# EAGLE design soccerbot (EAGLE 8.3.0)

## Sheet 1 of 4
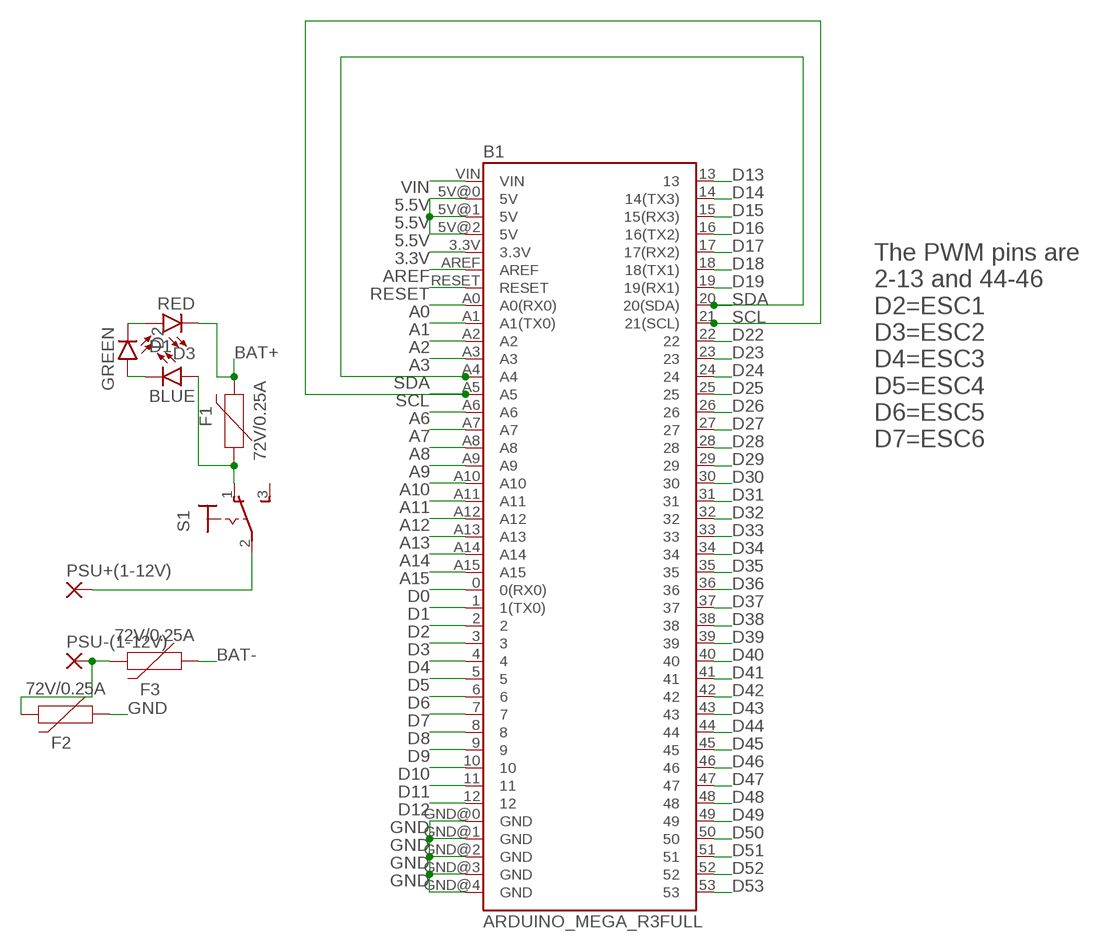
[diagram p0: schematic, sheet 1]

### Parts
B1  ARDUINO_MEGA_R3FULL  [ARDUINO_MEGA]
D1  BLUE  LED-BLUE1206  [LED-1206]
D2  GREEN  LED-GREEN0603  [LED-0603]
D3  RED  LED-RED0603  [LED-0603]
F1  72V/0.25A  PPTC_PTH  [PTH]
F2  72V/0.25A  PPTC_PTH  [PTH]
F3  72V/0.25A  PPTC_PTH  [PTH]
PSU+(1-12V)  SMD5  [SMD2,54-5,08]
PSU-(1-12V)  SMD5  [SMD2,54-5,08]
S1  320-916  [320-916]

### Nets
3.3V: B1.3.3V ; also sheet 2
5.5V: B1.5V@0(5V) B1.5V@1(5V) B1.5V@2(5V)
A0: B1.A0(A0(RX0))
A1: B1.A1(A1(TX0))
A2: B1.A2
A3: B1.A3
A6: B1.A6
A7: B1.A7
A8: B1.A8
A9: B1.A9
A10: B1.A10
A11: B1.A11
A12: B1.A12
A13: B1.A13
A14: B1.A14
A15: B1.A15
AREF: B1.AREF
BAT+: D3.C F1.P$2 ; also sheet 4
BAT-: F2.P$2 F3.P$1 F3.P$2 PSU-(1-12V).1(P) ; also sheet 4
D0: B1.0(0(RX0))
D1: B1.1(1(TX0))
D2: B1.2 ; also sheet 4
D3: B1.3 ; also sheet 4
D4: B1.4 ; also sheet 4
D5: B1.5 ; also sheet 4
D6: B1.6 ; also sheet 4
D7: B1.7 ; also sheet 4
D8: B1.8
D9: B1.9
D10: B1.10
D11: B1.11
D12: B1.12
D13: B1.13
D14: B1.14(14(TX3))
D15: B1.15(15(RX3))
D16: B1.16(16(TX2))
D17: B1.17(17(RX2))
D18: B1.18(18(TX1))
D19: B1.19(19(RX1))
D22: B1.22
D23: B1.23
D24: B1.24
D25: B1.25
D26: B1.26
D27: B1.27
D28: B1.28
D29: B1.29
D30: B1.30
D31: B1.31
D32: B1.32
D33: B1.33
D34: B1.34
D35: B1.35
D36: B1.36
D37: B1.37
D38: B1.38
D39: B1.39
D40: B1.40
D41: B1.41
D42: B1.42
D43: B1.43
D44: B1.44
D45: B1.45
D46: B1.46
D47: B1.47
D48: B1.48
D49: B1.49
D50: B1.50
D51: B1.51
D52: B1.52
D53: B1.53
GND: B1.GND@0(GND) B1.GND@1(GND) B1.GND@2(GND) B1.GND@3(GND) B1.GND@4(GND) F2.P$1 ; also sheet 2,3,4
N$3: D1.C D2.A
N$4: PSU+(1-12V).1(P) S1.2(P)
N$5: D2.C D3.A
N$6: D1.A F1.P$1 S1.1(O)
RESET: B1.RESET
SCL: B1.21(21(SCL)) B1.A5 ; also sheet 2,3
SDA: B1.20(20(SDA)) B1.A4 ; also sheet 2,3
VIN: B1.VIN ; also sheet 2,3,4
Unconnected: S1.3(S)

### Notes on the sheet
- The PWM pins are
  2-13 and 44-46
  D2=ESC1
  D3=ESC2
  D4=ESC3
  D5=ESC4
  D6=ESC5
  D7=ESC6

## Sheet 2 of 4
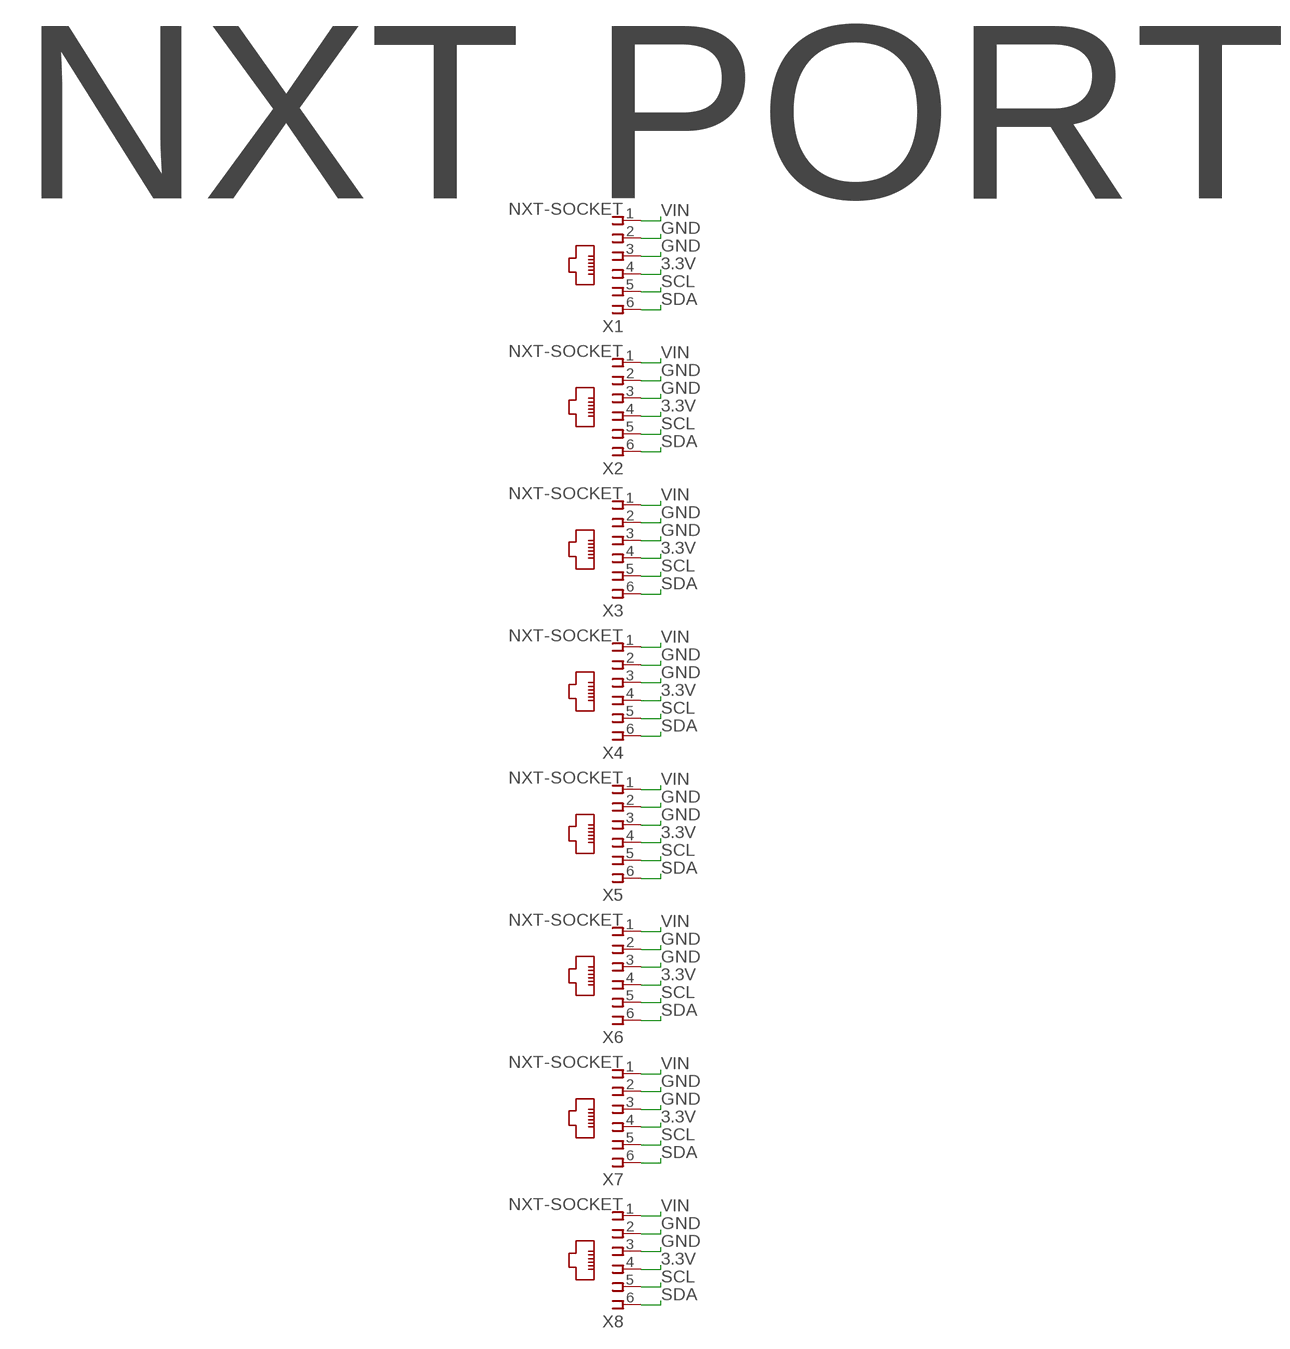
[diagram p1: schematic, sheet 2]

### Parts
X1  NXT-SOCKET  [NXT-SOCKET]
X2  NXT-SOCKET  [NXT-SOCKET]
X3  NXT-SOCKET  [NXT-SOCKET]
X4  NXT-SOCKET  [NXT-SOCKET]
X5  NXT-SOCKET  [NXT-SOCKET]
X6  NXT-SOCKET  [NXT-SOCKET]
X7  NXT-SOCKET  [NXT-SOCKET]
X8  NXT-SOCKET  [NXT-SOCKET]

### Nets
3.3V: X1.4 X2.4 X3.4 X4.4 X5.4 X6.4 X7.4 X8.4 ; also sheet 1
GND: X1.2 X1.3 X2.2 X2.3 X3.2 X3.3 X4.2 X4.3 X5.2 X5.3 X6.2 X6.3 X7.2 X7.3 X8.2 X8.3 ; also sheet 1,3,4
SCL: X1.5 X2.5 X3.5 X4.5 X5.5 X6.5 X7.5 X8.5 ; also sheet 1,3
SDA: X1.6 X2.6 X3.6 X4.6 X5.6 X6.6 X7.6 X8.6 ; also sheet 1,3
VIN: X1.1 X2.1 X3.1 X4.1 X5.1 X6.1 X7.1 X8.1 ; also sheet 1,3,4

### Notes on the sheet
- NXT PORTS

## Sheet 3 of 4
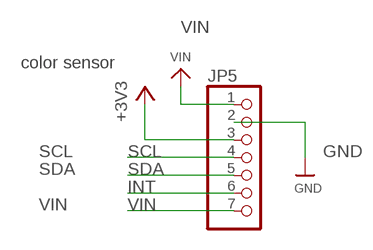
[diagram p2: schematic, sheet 3]

### Parts
JP5  HEADER-1X770MIL  [1X07_ROUND_70]

### Nets
+3V3: JP5.3
GND: JP5.2 ; also sheet 1,2,4
INT: JP5.6
SCL: JP5.4 ; also sheet 1,2
SDA: JP5.5 ; also sheet 1,2
VIN: JP5.1 JP5.7 ; also sheet 1,2,4

### Notes on the sheet
- color sensor

## Sheet 4 of 4
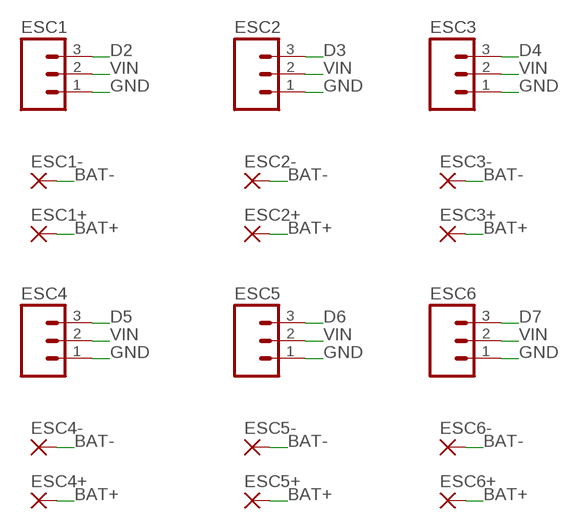
[diagram p3: schematic, sheet 4]

### Parts
ESC1  M03LOCK  [1X03_LOCK]
ESC1+  SMD5  [SMD2,54-5,08]
ESC1-  SMD5  [SMD2,54-5,08]
ESC2  M03LOCK  [1X03_LOCK]
ESC2+  SMD5  [SMD2,54-5,08]
ESC2-  SMD5  [SMD2,54-5,08]
ESC3  M03LOCK  [1X03_LOCK]
ESC3+  SMD5  [SMD2,54-5,08]
ESC3-  SMD5  [SMD2,54-5,08]
ESC4  M03LOCK  [1X03_LOCK]
ESC4+  SMD5  [SMD2,54-5,08]
ESC4-  SMD5  [SMD2,54-5,08]
ESC5  M03LOCK  [1X03_LOCK]
ESC5+  SMD5  [SMD2,54-5,08]
ESC5-  SMD5  [SMD2,54-5,08]
ESC6  M03LOCK  [1X03_LOCK]
ESC6+  SMD5  [SMD2,54-5,08]
ESC6-  SMD5  [SMD2,54-5,08]

### Nets
BAT+: ESC1+.1(P) ESC2+.1(P) ESC3+.1(P) ESC4+.1(P) ESC5+.1(P) ESC6+.1(P) ; also sheet 1
BAT-: ESC1-.1(P) ESC2-.1(P) ESC3-.1(P) ESC4-.1(P) ESC5-.1(P) ESC6-.1(P) ; also sheet 1
D2: ESC1.3 ; also sheet 1
D3: ESC2.3 ; also sheet 1
D4: ESC3.3 ; also sheet 1
D5: ESC4.3 ; also sheet 1
D6: ESC5.3 ; also sheet 1
D7: ESC6.3 ; also sheet 1
GND: ESC1.1 ESC2.1 ESC3.1 ESC4.1 ESC5.1 ESC6.1 ; also sheet 1,2,3
VIN: ESC1.2 ESC2.2 ESC3.2 ESC4.2 ESC5.2 ESC6.2 ; also sheet 1,2,3

## Library data of the parts
B1 = SparkFun-Boards:ARDUINO_MEGA_R3: Arduino Mega R3 ATmega2560 R3 compatible footprint. SparkFun Products: Arduino Mega 2560 R3 <https://www.sparkfun.com/products/11061>; OC_NEWARK: unknown
D1 = SparkFun-LED:LED-BLUE: Blue SMD LED Used in manufacturing of various products at SparkFun Packages: 0603 - SMD 0603 package [Product Link] <http://www.digikey.com/product-detail/en/SMLE12BC7TT86/511-1589-2-ND/1641808> 1206 - SMD1206 package [Product Link] <http://www.digikey.com/product-detail/en/lite-on-inc/LTST-C150TBKT/160-1643-1-ND/573584> SparkFun Products: ESP8266 Thing-Dev Board <https://www.sparkfun.com/products/13711> RedBoard <https://www.sparkfun.com/products/12757>; MPN: TLMB1100-GS08; OC_NEWARK: 03P9480; PROD_ID: DIO-09911
D2 = SparkFun-LED:LED-GREEN: Green SMD LED Used in manufacturing of various products at SparkFun Packages: 0603 - SMD 0603 package [Product Link] <http://www.futureelectronics.com/en/technologies/semiconductors/optoelectronics/leds/Pages/9894312-LTST-C190GKT.aspx?CrossPart=HSMG-C190&IM=0> LilyPad 1206 - SMD1206 LilyPad package [Product Link] <http://www.futureelectronics.com/en/Technologies/Product.aspx?ProductID=IN150NGHARVATEKCORPORATION2049943&IM=0> 1206 - SMD1206 package [Product Link] <http://www.futureelectronics.com/en/technologies/semiconductors/optoelectronics/leds/Pages/8315665-LTST-C150KGKT.aspx?IM=0> 1206 Bottom Mount -SMD 1206 Bottom Mount [Product Link] <http://www.digikey.com/product-detail/en/lite-on-inc/LTST-C230KGKT/160-1456-1-ND/386854> SparkFun Products: Pro Mini 328 -5V <https://www.sparkfun.com/products/821> RedBoard <https://www.sparkfun.com/products/12757> MP3 Trigger <https://www.sparkfun.com/products/13720> Makey Makey <https://www.sparkfun.com/products/11076>; MF: SLI (CML/IDI); MPN: CMD15-21VGC/TR8; OC_NEWARK: 15M8857; PROD_ID: DIO-00821
D3 = SparkFun-LED:LED-RED: Red SMD LED Used in manufacturing of most products at SparkFun Packages: 0603 - SMD 0603 package [Product Link] <http://docs.avagotech.com/docs/AV02-0551EN> 0603 SMART - SMD 0603 SMART package ( more efficient and expensive)[Product Link] <http://www.osram-os.com/Graphics/XPic2/00077099_0.pdf> 1206 - SMD1206 package [Product Link] <https://www.sparkfun.com/datasheets/DevTools/LilyPad/Q150OVS4.pdff> SparkFun Products: Pro Mini 328 -5V <https://www.sparkfun.com/products/821> RedBoard <https://www.sparkfun.com/products/12757> IOIO-OTG <https://www.sparkfun.com/products/13613>; MPN: LSQ976-Z; OC_NEWARK: 05M0541; PROD_ID: DIO-00819
ESC1-ESC6 = SparkFun:M03: Header 3 Standard 3-pin 0.1" header. Use with straight break away headers (SKU : PRT-00116), right angle break away headers (PRT-00553), swiss pins (PRT-00743), machine pins (PRT-00117), and female headers (PRT-00115). Molex polarized connector foot print use with SKU : PRT-08232 with associated crimp pins and housings.; MF: MOLEX; MPN: 22-11-2032; OC_NEWARK: 81C8218
ESC1+ ESC1- ESC2+ ESC2- ESC3+ ESC3- ESC4+ ESC4- ESC5+ ESC5- ESC6+ ESC6- PSU+(1-12V) PSU-(1-12V) = wirepad:SMD5: SMD PAD; OC_NEWARK: unknown
F1-F3 = SparkFun-Fuses:PPTC: Resettable Fuse PPTC Resettable Fuse. Really a sort of resistor with a polymeric positive temperature coefficient whose resistance increases dramatically with an increase in temperature. When heated by the power passing through the resistance rises causing the current to be limited, protecting the circuit. This is achieved by the transition of the polymer from a crystalline to an amorphous state where the conductive carbon separates breaking the conductive pathways found in the cool crystalline structure. When a PPTC cools back down it resumes conducting letting the circuit turn back on. SparkFun Products: SparkFun RedBoard - Programmed with Arduino <https://www.sparkfun.com/products/12757> Pro Micro - 5V/16MHz <https://www.sparkfun.com/products/12640> Arduino Pro 328 - 5V/16MHz <https://www.sparkfun.com/products/10915> MP3 Trigger <https://www.sparkfun.com/products/13720>; MF: RAYCHEM/POLYSWITCH; MPN: RGEF250; OC_NEWARK: 04H7805; PROD_ID: RES-08490
JP5 = microbuilder:HEADER-1X7: PIN HEADER; OC_NEWARK: unknown
S1 = switch:320-916: TOGGLE SWITCH distributor RS Components; MPN: 5636A9; OC_NEWARK: 13M4539
X1-X8 = NXT Compatible (female) Sockets - Mindsensors:NXT-SOCKET: RJ11 6 connects Manufacturer: Mindsensors.com Source: NXT-Female-Socket.pdf; OC_FARNELL: unknown; OC_NEWARK: unknown

## Board
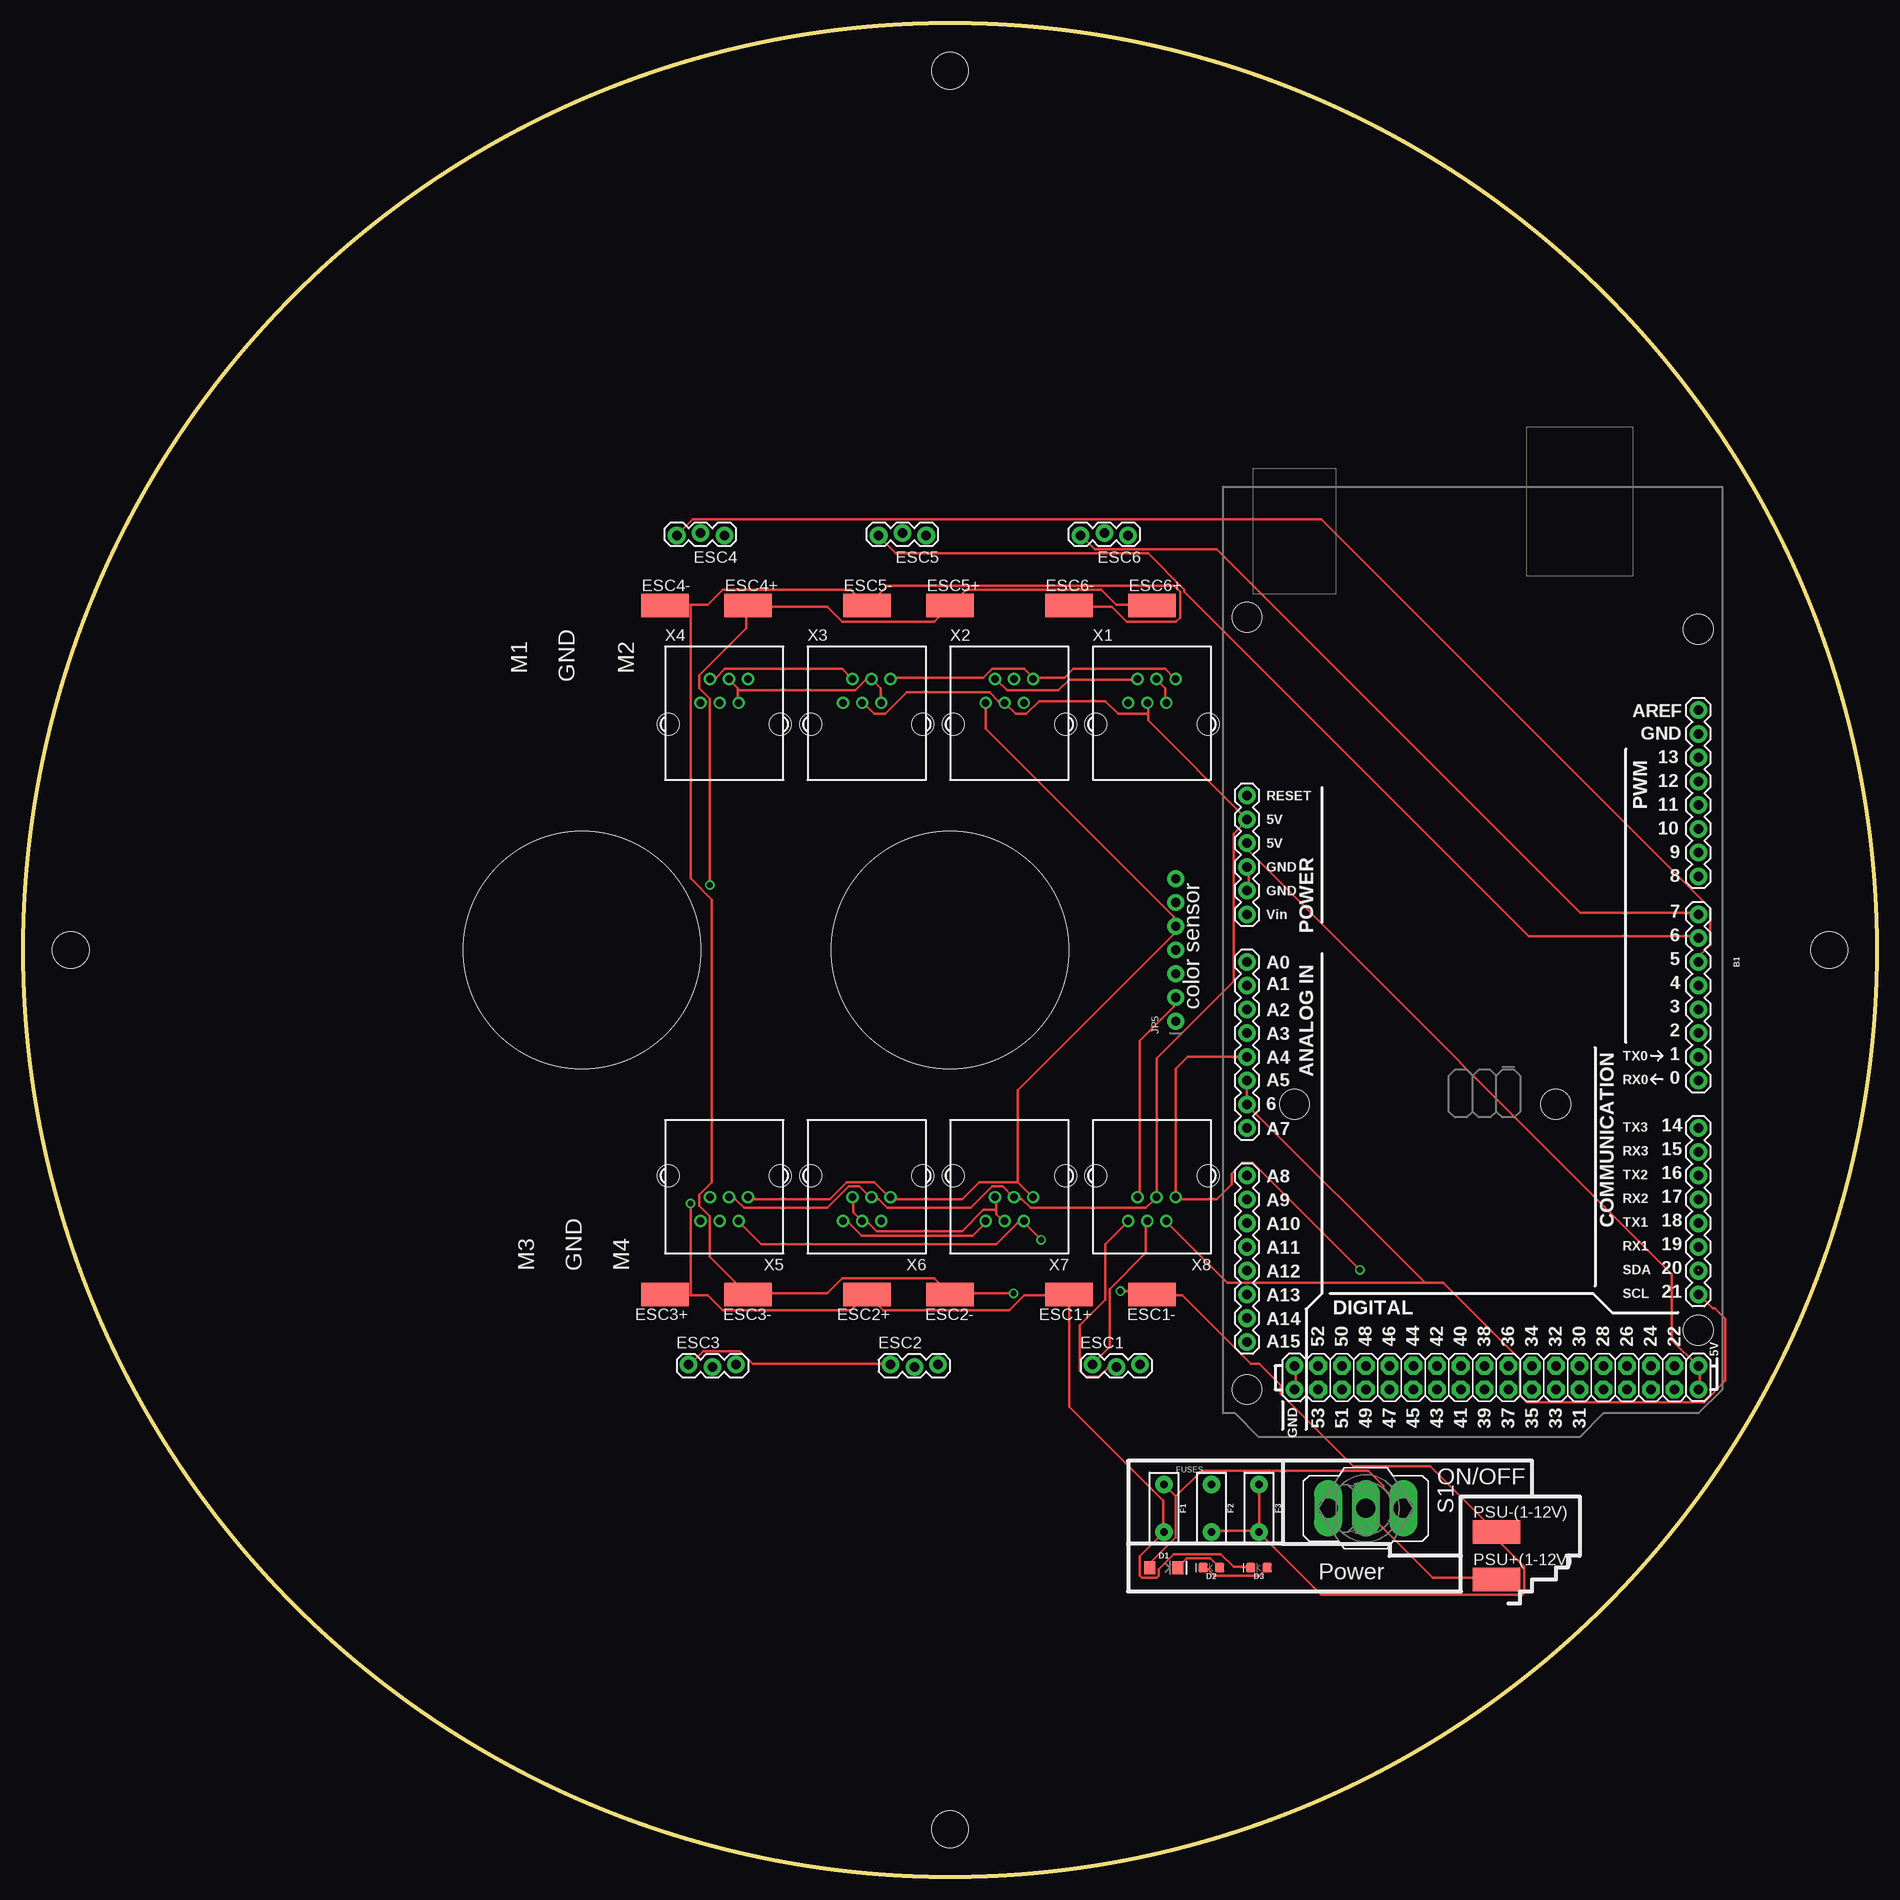
[diagram p4: board, top side]
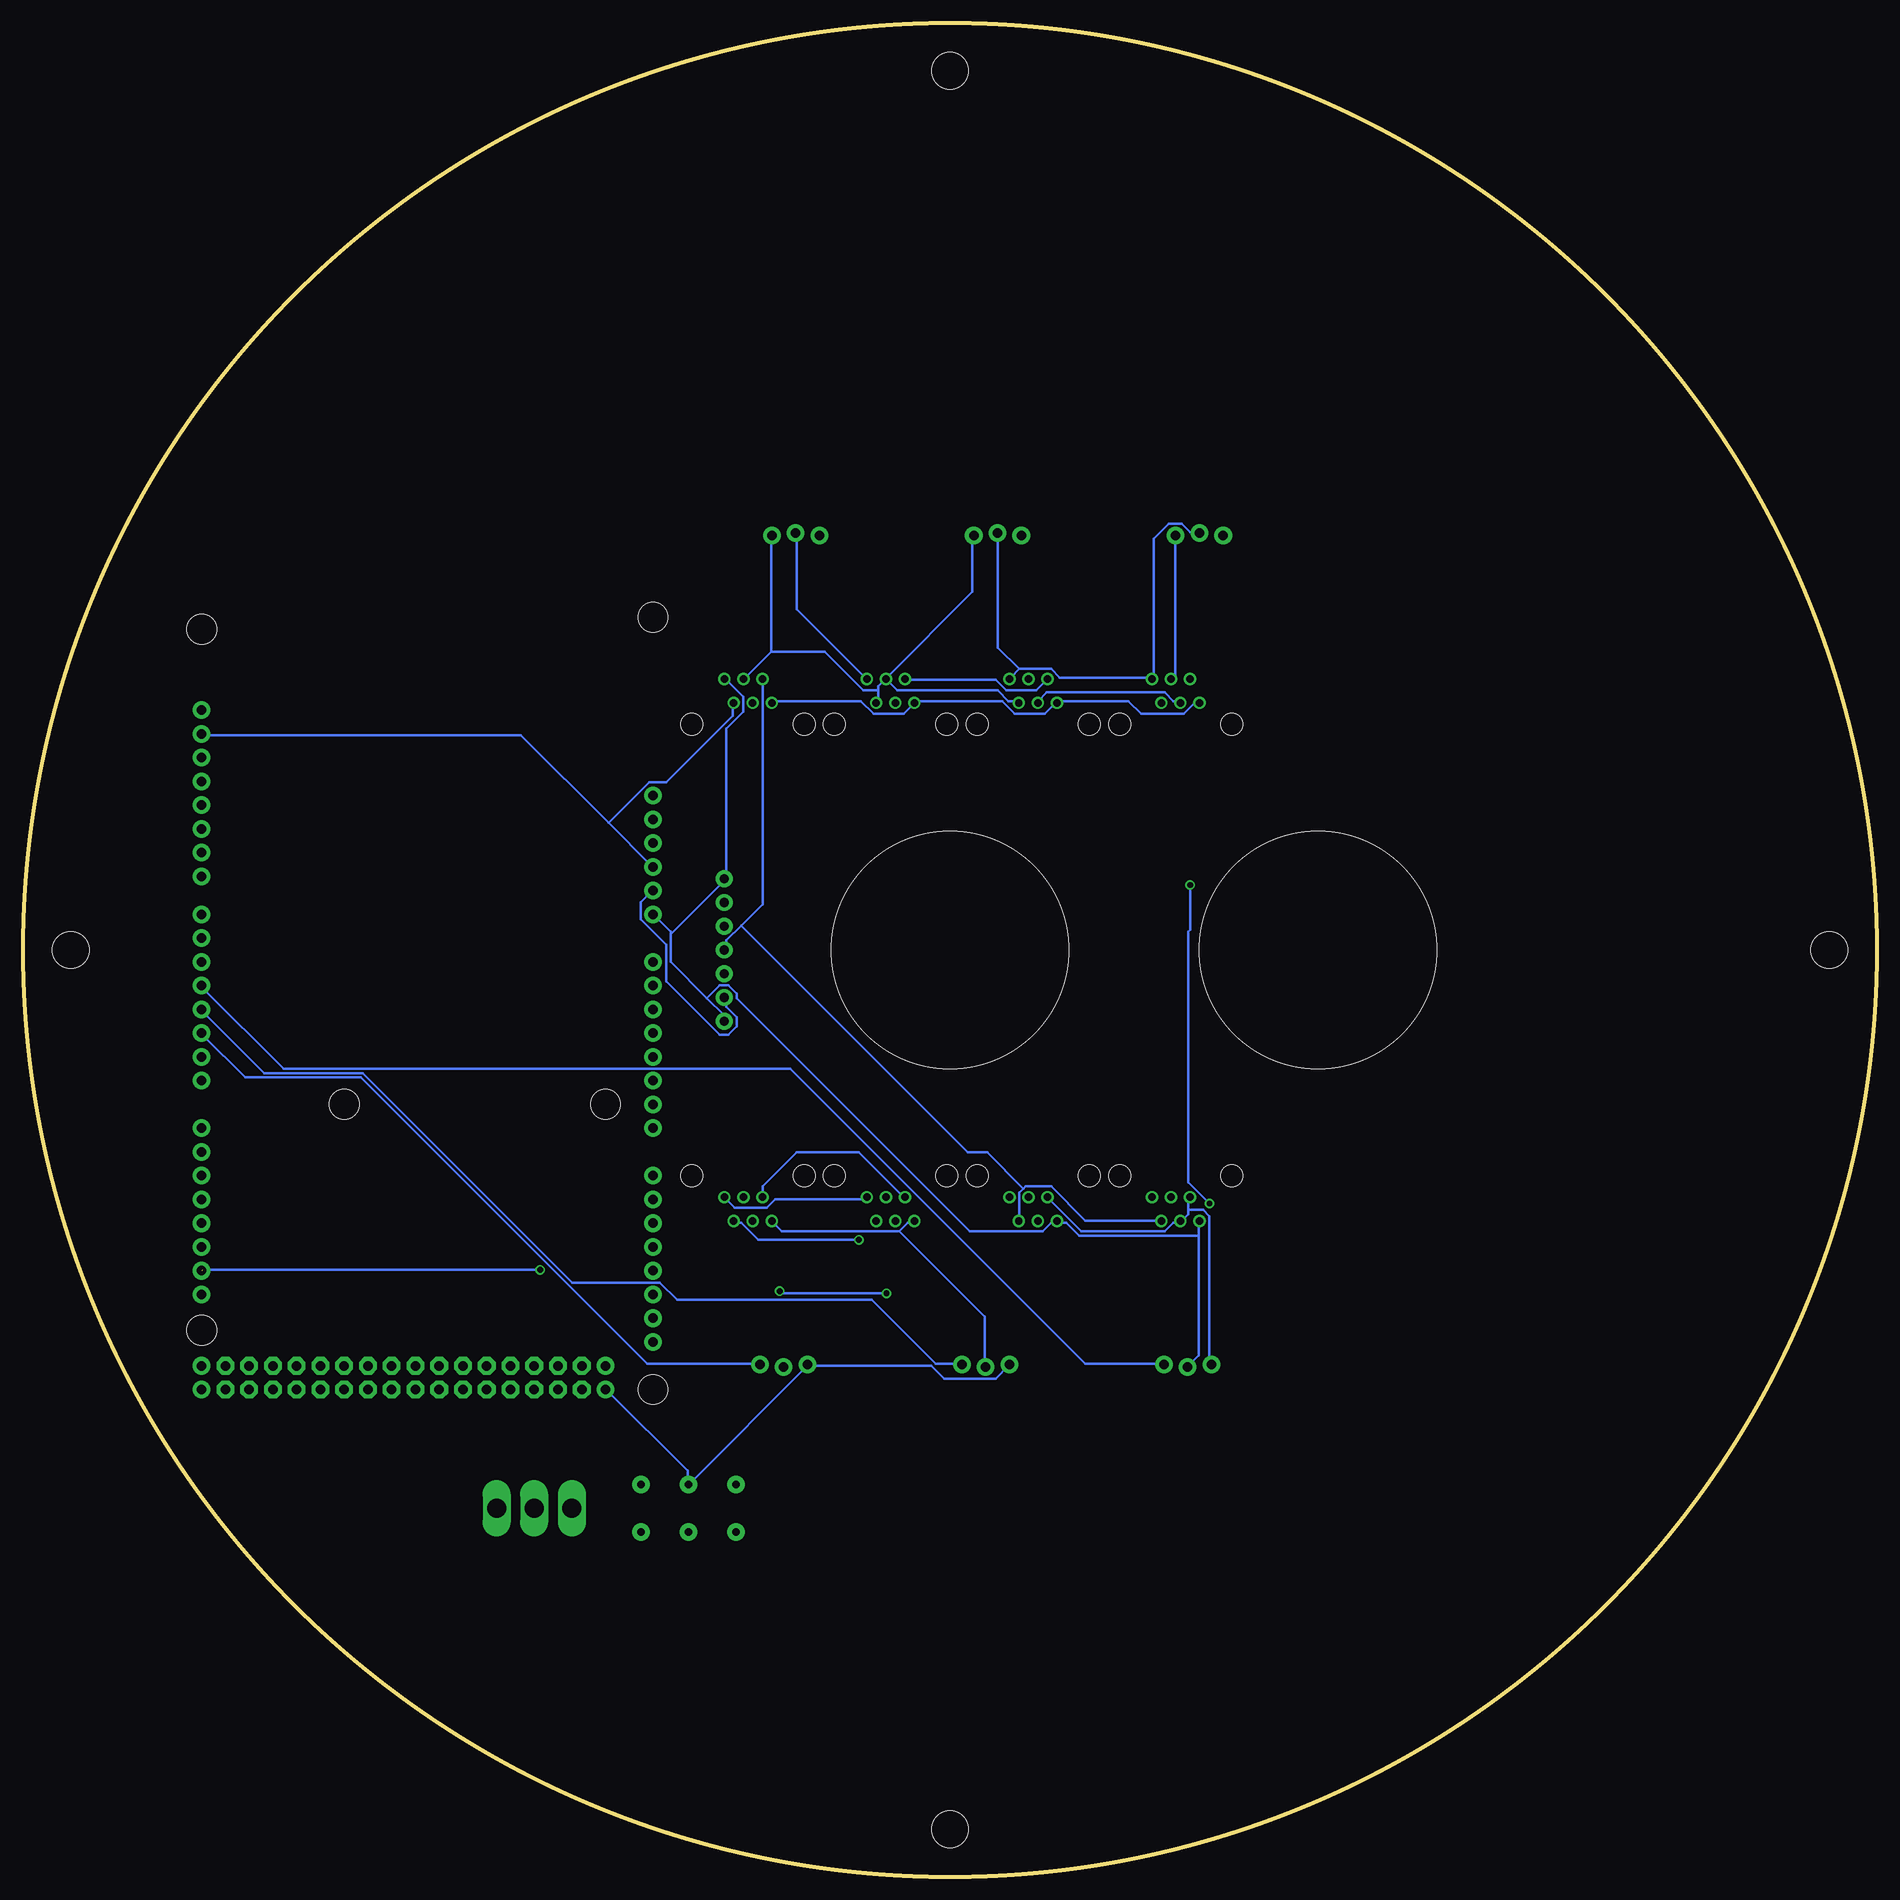
[diagram p5: board, bottom side, seen from below]

Size 198.14 x 198.14 mm. Coordinates in mm from the lower left corner, seen from the top.
Outline: circle at 99.07,99.07 radius 99.07
Copper layers (1*16): Top 0.035mm / dielectric 1.5mm / Bottom 0.035mm
Design rules "default": minimum track width 10mil, minimum drill 24mil, track to track 8mil, track to pad 8mil, pad to pad 8mil, via to via 8mil, smd to smd 8mil, copper to edge 40mil, drill to drill 8mil, minimum pad ring 10mil, minimum via ring 8mil, stop-mask expansion 4mil, vias tented up to drill 0mil, thermal gap 10mil
Holes 3.96 mm at 99.07,5.09 99.07,193.05 5.09,99.07 193.05,99.07
Holes 25.4 mm at 59.7,99.07 99.07,99.07

### Footprints (pad centres in the part's own frame; a part is rotated, then mirrored left to right if it is on the bottom)
ARDUINO_MEGA = drill 1.016 pad 1.88: 0 13.97,24.13; 1 11.43,24.13; 2 8.89,24.13; 3 6.35,24.13; 3.3V -13.97,-24.13; 4 3.81,24.13; 5 1.27,24.13; 5V@0 -11.43,-24.13; 5V@1 44.45,24.13; 5V@2 46.99,24.13; 6 -1.27,24.13; 7 -3.81,24.13; 8 -7.874,24.13; 9 -10.414,24.13; 10 -12.954,24.13; 11 -15.494,24.13; 12 -18.034,24.13; 13 -20.574,24.13; 14 19.05,24.13; 15 21.59,24.13; 16 24.13,24.13; 17 26.67,24.13; 18 29.21,24.13; 19 31.75,24.13; 20 34.29,24.13; 21 36.83,24.13; A0 1.27,-24.13; A1 3.81,-24.13; A2 6.35,-24.13; A3 8.89,-24.13; A4 11.43,-24.13; A5 13.97,-24.13; A6 16.51,-24.13; A7 19.05,-24.13; A8 24.13,-24.13; A9 26.67,-24.13; A10 29.21,-24.13; A11 31.75,-24.13; A12 34.29,-24.13; A13 36.83,-24.13; A14 39.37,-24.13; A15 41.91,-24.13; AREF -25.654,24.13; GND@0 -8.89,-24.13; GND@1 -6.35,-24.13; GND@2 44.45,-19.05; GND@3 46.99,-19.05; GND@4 -23.114,24.13; RESET -16.51,-24.13; VIN -3.81,-24.13 | drill 1.016 pad 1.88 octagon: 22 44.45,21.59; 23 46.99,21.59; 24 44.45,19.05; 25 46.99,19.05; 26 44.45,16.51; 27 46.99,16.51; 28 44.45,13.97; 29 46.99,13.97; 30 44.45,11.43; 31 46.99,11.43; 32 44.45,8.89; 33 46.99,8.89; 34 44.45,6.35; 35 46.99,6.35; 36 44.45,3.81; 37 46.99,3.81; 38 44.45,1.27; 39 46.99,1.27; 40 44.45,-1.27; 41 46.99,-1.27; 42 44.45,-3.81; 43 46.99,-3.81; 44 44.45,-6.35; 45 46.99,-6.35; 46 44.45,-8.89; 47 46.99,-8.89; 48 44.45,-11.43; 49 46.99,-11.43; 50 44.45,-13.97; 51 46.99,-13.97; 52 44.45,-16.51; 53 46.99,-16.51 | hole 3.2: -34.29,24.13; -35.56,-24.13; 16.51,8.89; 16.51,-19.05; 40.64,24.13; 46.99,-24.13
LED-1206 = smd 1.2 x 1.4: A -1.5,0; C 1.5,0
LED-0603 = smd 1 x 1: A -0.877,0; C 0.877,0
1X03_LOCK = drill 1.016 pad 1.88: 1 0,0.127; 2 2.54,-0.127; 3 5.08,0.127
SMD2,54-5,08 = smd 2.54 x 5.08: 1 0,0
PTH = drill 0.8 pad 1.88: P$1 -2.54,0; P$2 2.54,0
1X07_ROUND_70 = drill 1 pad 1.778: 1 -7.62,0; 2 -5.08,0; 3 -2.54,0; 4 0,0; 5 2.54,0; 6 5.08,0; 7 7.62,0
320-916 = drill 2.007 long: 1 0,4.013; 2 0,0; 3 0,-4.013
NXT-SOCKET = drill 0.8 pad 1.3: 1 2.54,4.84; 2 1.54,2.3; 3 0.5,4.84; 4 -0.5,2.3; 5 -1.54,4.84; 6 -2.54,2.3 | hole 2.36: -6,0; 6,0

### Placement (x,y rotation side)
B1  154.95,99.07 270 top
D1  121.93,33.03 0 top
D2  127.01,33.03 180 top
D3  132.09,33.03 180 top
ESC1  114.31,54.62 0 top
ESC1+  111.77,62.24 90 top
ESC1-  120.66,62.24 90 top
ESC2  92.72,54.62 0 top
ESC2+  90.18,62.24 90 top
ESC2-  99.07,62.24 90 top
ESC3  71.13,54.62 0 top
ESC3+  68.59,62.24 90 top
ESC3-  77.48,62.24 90 top
ESC4  74.94,143.52 180 top
ESC4+  77.48,135.9 270 top
ESC4-  68.59,135.9 270 top
ESC5  96.53,143.52 180 top
ESC5+  99.07,135.9 270 top
ESC5-  90.18,135.9 270 top
ESC6  118.12,143.52 180 top
ESC6+  120.66,135.9 270 top
ESC6-  111.77,135.9 270 top
F1  121.93,39.38 270 top
F2  127.01,39.38 270 top
F3  132.09,39.38 270 top
JP5  123.2,99.07 90 top
PSU+(1-12V)  157.49,31.76 270 top
PSU-(1-12V)  157.49,36.84 270 top
S1  143.52,39.38 270 top
X1  120.66,123.2 0 top
X2  105.42,123.2 0 top
X3  90.18,123.2 0 top
X4  74.94,123.2 0 top
X5  74.94,74.94 180 top
X6  90.18,74.94 180 top
X7  105.42,74.94 180 top
X8  120.66,74.94 180 top

### Tracks (layer width: path | path; a pad name or v marks a point on that pad's centre or on a via)
3.3V
  Top 0.254: X5.4 75.45,72.42 76.13,72.42 77.05,71.51 85.96,71.51 88.25,73.8 89.39,73.8 90.53,72.65 X6.4 90.76,72.42 91.45,72.42 92.36,71.51 101.28,71.51 103.56,73.8 104.71,73.8 105.85,72.65 X7.4 106.08,72.42 106.76,72.42 107.68,71.51 120.02,71.51 120.94,72.42 X8.4 121.17,72.65 121.17,87.51 129.4,95.74 129.4,111.51 130.77,112.89 B1.3.3V 130.77,113.11 120.25,123.63 120.25,124.32 | 120.25,124.32 120.25,125.46 X1.4 | X3.4 89.85,125.46 90.99,124.32 92.13,124.32 94.42,126.6 103.34,126.6 104.25,125.69 104.71,125.69 X2.4 104.94,125.46 106.08,124.32 107.22,124.32 108.59,125.69 115.68,125.69 117.05,124.32 120.25,124.32
  Bottom 0.254: X4.4 74.53,125.69 75.22,125.69 76.13,126.6 88.71,126.6 89.62,125.69 X3.4
5.5V
  Top 0.254: B1.5V@2 179.23,52.08 179.23,54.59 B1.5V@1 179,54.59 176.26,57.34 176.26,64.42 131,109.69 131,110.37 B1.5V@0
BAT+  (via drill 0.61)
  Top 0.254: ESC6+.1 120.48,135.97 116.82,135.97 115.22,137.57 100.82,137.57 99.22,135.97 ESC5+.1 98.99,135.75 97.39,134.15 87.56,134.15 85.96,135.75 77.5,135.75 ESC4+.1 77.28,135.75 77.28,133.46 72.25,128.43 72.25,127.06 73.39,125.92 v73.39,106.03 | D3.C 131,33.1 129.4,33.1 128.02,34.48 123,34.48 121.4,32.88 121.4,32.19 121.17,31.96 119.57,31.96 119.34,32.19 119.34,34.25 F1.P$2 121.85,36.99 121.85,40.19 111.79,50.25 111.79,62.14 ESC1+.1 111.57,62.14 106.99,62.14 105.39,60.54 91.91,60.54 90.31,62.14 ESC2+.1 88.48,60.54 74.76,60.54 73.16,62.14 71.33,62.14 | 71.33,62.14 68.59,62.14 ESC3+.1 | 71.33,62.14 v71.33,71.97
  Bottom 0.254: v73.39,106.03 73.39,101.23 73.62,101 73.62,74.25 v71.33,71.97
BAT-  (via drill 0.61)
  Top 0.254: 71.33,135.97 73.16,135.97 74.76,137.57 88.48,137.57 90.08,135.97 ESC5-.1 90.31,135.97 92.36,138.03 123,138.03 123.68,137.35 123.68,134.6 123.22,134.15 117.97,134.15 116.37,135.75 111.79,135.75 ESC6-.1 | 71.33,135.97 68.59,135.97 ESC4-.1 | F2.P$2 127.11,36.99 131.91,36.99 F3.P$2 | F3.P$1 132.14,41.79 132.14,36.99 F3.P$2 | F3.P$2 132.14,36.76 138.77,30.13 160.26,30.13 160.49,30.36 160.49,33.1 157.51,36.08 157.51,36.76 PSU-(1-12V).1 157.29,36.99 150.43,43.85 142.2,43.85 134.43,51.62 134.43,52.54 132.14,54.82 131.22,54.82 123.91,62.14 120.71,62.14 ESC1-.1 120.48,62.37 120.25,62.59 v117.28,62.59 | v105.85,62.37 99.22,62.37 ESC2-.1 98.99,62.37 97.39,63.97 87.56,63.97 85.96,62.37 77.5,62.37 ESC3-.1 77.28,62.37 73.39,66.25 73.39,70.6 72.25,71.74 72.25,72.88 73.62,74.25 73.62,104.43 71.33,106.71 71.33,135.97
  Bottom 0.254: v105.85,62.37 117.05,62.37 v117.28,62.59
D2
  Bottom 0.254: ESC1.3 119.57,54.82 131.45,54.82 162.09,85.45 174.43,85.45 179,90.03 B1.2
D3
  Bottom 0.254: ESC2.3 97.85,54.82 100.59,54.82 107.45,61.68 128.25,61.68 130.08,63.51 139.45,63.51 161.86,85.91 172.37,85.91 179,92.54 B1.3
D4
  Bottom 0.254: ESC3.3 76.36,54.82 84.59,54.82 116.14,86.37 170.32,86.37 179,95.06 B1.4
D5
  Top 0.254: B1.5 179.23,97.8 179.23,98.48 180.37,99.63 180.37,103.51 138.77,145.12 71.56,145.12 69.96,143.52 ESC4.3
D6
  Top 0.254: B1.6 179,100.54 160.94,100.54 124.14,137.35 124.14,137.57 120.25,141.46 93.28,141.46 91.45,143.29 ESC5.3
D7
  Top 0.254: B1.7 179,103.06 166.43,103.06 127.57,141.92 114.54,141.92 113.17,143.29 ESC6.3
GND
  Top 0.254: X8.3 120.02,69.91 120.02,66.71 116.14,62.82 116.14,56.65 114.31,54.82 ESC1.1 | B1.GND@2 136.03,54.59 136.03,52.08 B1.GND@3 | ESC2.1 92.59,54.82 77.96,54.82 76.59,56.19 72.7,56.19 71.33,54.82 ESC3.1 | X6.2 88.71,72.42 88.71,71.05 89.62,70.14 X6.3 89.85,69.91 90.31,69.91 91.22,68.99 100.36,68.99 102.65,71.28 104.02,71.28 | 104.02,71.28 104.02,70.82 104.71,70.14 X7.3 | 104.02,71.28 104.02,72.42 X7.2 | JP5.2 123,93.91 123,93 119.34,89.34 119.34,72.65 X8.2 | X3.2 91.68,125.69 91.68,127.06 90.76,127.97 X3.3 90.53,127.97 90.08,127.97 88.93,126.83 76.36,126.83 | 76.36,126.83 76.36,127.06 75.45,127.97 X4.3 | 76.36,126.83 76.36,125.69 X4.2 | X1.2 122.08,125.69 122.08,127.06 121.17,127.97 X1.3 | B1.GND@1 131,105.57 131,107.86 B1.GND@0
  Bottom 0.254: B1.GND@3 135.8,52.08 127.11,43.39 127.11,42.02 F2.P$1 126.88,42.02 114.31,54.59 | 73.62,71.28 73.62,70.82 74.3,70.14 X5.3 74.53,69.91 75.22,69.91 76.13,68.99 85.05,68.99 88.48,72.42 X6.2 | 73.62,71.28 73.62,72.42 X5.2 | 73.62,71.28 72.02,71.28 71.33,70.6 71.33,54.82 ESC3.1 | X8.2 119.11,72.65 119.11,73.8 115.45,77.45 108.82,77.45 104.02,72.65 X7.2 | 114.31,54.59 101.05,54.59 99.68,53.22 94.19,53.22 92.82,54.59 ESC2.1 | 114.31,54.59 ESC1.1 | ESC4.1 74.99,143.29 74.99,128.43 75.22,128.2 X4.3 | 118.19,130.95 118.19,143.29 ESC6.1 | 118.19,130.95 120.94,128.2 X1.3 | 106.76,126.83 106.76,127.29 106.08,127.97 X2.3 | 106.76,126.83 106.76,125.69 X2.2 | ESC5.1 96.71,143.29 96.71,137.35 105.85,128.2 X2.3 | 118.19,130.95 112.48,130.95 108.36,126.83 106.76,126.83 | X3.2 91.91,125.69 92.82,125.69 93.96,126.83 104.71,126.83 105.85,127.97 X2.3 | 135.57,112.66 131,108.09 B1.GND@0 | 135.57,112.66 144.94,122.03 179,122.03 B1.GND@4 | 135.57,112.66 131.22,117 129.4,117 122.31,124.09 122.31,125.46 X1.2 | JP5.2 123,93.91 123,93 121.85,91.85 121.85,90.94 122.77,90.03 123.68,90.03 129.4,95.74 129.4,99.63 132.14,102.37 132.14,104.2 131,105.34 B1.GND@1
N$3
  Top 0.254: D2.A 127.8,33.1 126.88,34.02 124.37,34.02 123.45,33.1 D1.C
N$4
  Top 0.254: PSU+(1-12V).1 157.29,31.96 150.66,31.96 143.34,39.28 S1.2
N$5
  Top 0.254: D2.C 126.2,32.88 126.65,32.88 127.34,32.19 132.14,32.19 132.83,32.88 D3.A
N$6
  Top 0.254: 123.22,40.65 123.22,36.31 120.48,33.56 120.48,33.1 D1.A | 123.22,40.65 122.08,41.79 F1.P$1 | 123.22,40.65 125.97,43.39 143.8,43.39 145.4,41.79 145.4,41.56 147.46,39.51 S1.1
SCL  (via drill 0.61)
  Top 0.254: X4.5 73.62,128.2 74.07,128.2 74.99,129.12 87.56,129.12 88.48,128.2 X3.5 | X1.5 119.11,127.97 111.79,127.97 110.65,126.83 105.16,126.83 104.02,127.97 X2.5 | X5.5 76.59,69.91 78.88,67.62 104.02,67.62 106.31,69.91 106.76,69.91 X7.5 106.99,69.91 v108.82,68.08 | 149.85,63.51 128.71,63.51 122.31,69.91 X8.5 | 149.85,63.51 151.8,63.51 160.03,55.28 160.03,51.39 160.71,50.71 179.69,50.71 181.97,52.99 181.97,59.62 180.83,60.77 180.6,60.77 179.23,62.14 B1.21 | B1.A5 130.82,82.54 149.85,63.51
  Bottom 0.254: X2.5 103.79,127.97 94.19,127.97 93.05,126.83 89.85,126.83 88.71,127.97 X3.5 | 121.4,101.68 119.11,103.97 119.11,127.97 X1.5 | 121.4,101.68 123,100.08 123,99.17 JP5.4 | 91.22,73.57 91.68,73.11 91.68,70.14 X6.5 | 91.22,73.57 90.99,73.8 88.25,73.8 84.59,70.14 76.59,70.14 X5.5 | v108.82,68.08 119.57,68.08 121.4,69.91 122.08,69.91 X8.5 | 121.4,101.68 97.16,77.45 95.11,77.45 91.22,73.57
SDA  (via drill 0.61)  (1 unrouted)
  Top 0.254: X2.6 102.88,122.72 123,102.6 123,101.68 JP5.5 123,101.46 123,100.77 106.31,84.08 106.31,74.25 | X5.6 77.5,72.42 86.19,72.42 88.02,74.25 90.99,74.25 92.59,72.65 X6.6 92.82,72.42 100.36,72.42 102.19,74.25 106.31,74.25 | v142.88,64.88 131.45,76.31 130.31,76.31 129.17,75.17 129.17,74.02 127.57,72.42 123.22,72.42 X8.6 123.2,86.37 124.47,87.64 B1.A4 | 106.31,74.25 107.91,72.65 X7.6
  Bottom 0.254: X4.6 72.47,125.46 72.93,125.46 74.07,124.32 78.65,124.32 80.02,125.69 87.56,125.69 X3.6 87.79,125.46 88.93,124.32 92.13,124.32 93.51,125.69 102.88,125.69 X2.6 102.88,125.46 104.02,124.32 107.22,124.32 108.59,125.69 117.97,125.69 X1.6 | X7.6 108.14,72.42 117.74,72.42 118.65,71.51 122.08,71.51 123,72.42 X8.6 | v142.88,64.88 179,64.88
VIN
  Top 0.254: ESC1.2 116.82,54.36 115.91,54.36 114.99,53.45 113.62,53.45 112.94,54.14 112.94,58.94 115.68,61.68 115.68,67.62 117.97,69.91 X8.1 | X6.1 87.79,69.91 88.25,69.91 89.62,68.54 101.51,68.54 102.88,69.91 X7.1 | X1.1 123,128.2 122.08,129.12 112.25,129.12 111.34,128.2 108.14,128.2 X2.1 107.91,128.2 106.99,129.12 103.56,129.12 102.65,128.2 92.82,128.2 X3.1
  Bottom 0.254: 72.47,68.54 72.47,55.74 73.62,54.59 ESC3.2 | 72.47,68.54 72.47,69.91 X5.1 | 72.47,68.54 85.28,68.54 86.65,69.91 87.56,69.91 X6.1 87.79,69.91 88.25,69.91 89.16,68.99 96.93,68.99 121.85,93.91 121.85,94.37 122.77,95.28 123.68,95.28 125.05,93.91 | 104.48,68.99 103.56,69.91 102.88,69.91 X7.1 | 104.48,68.99 117.05,68.99 117.97,69.91 X8.1 | 104.48,68.99 95.33,59.85 95.33,54.59 ESC2.2 | 91.68,129.12 88.25,129.12 87.33,128.2 77.5,128.2 X4.1 77.28,128.2 77.28,143.06 75.68,144.66 74.3,144.66 73.39,143.75 72.47,143.75 ESC4.2 | 91.68,129.12 92.59,128.2 X3.1 | 91.68,129.12 93.96,131.4 93.96,143.52 ESC5.2 | 125.05,93.91 128.94,97.8 128.94,100.77 | 125.05,93.91 123.22,92.08 123.22,91.63 JP5.1 | 128.94,100.77 128.94,101 B1.VIN | 128.94,100.77 123.22,106.49 JP5.7 123,106.71 123,122.72 121.17,124.54 121.17,126.14 123,127.97 X1.1 | ESC6.2 115.45,143.52 115.45,135.52 108.14,128.2 X2.1

### Text on the board
tNames: GND | M1 | M2 | color sensor | M3 | GND | M4 | FUSES | ON/OFF | Power
tValues: PWM | - | + | PWM | - | + | PWM | - | + | D5 | D6 | D7 | VIN | INT | SDA | SCL | 3V3 | GND | VIN | D4 | D3 | D2 | + | - | PWM | + | - | PWM | + | - | PWM